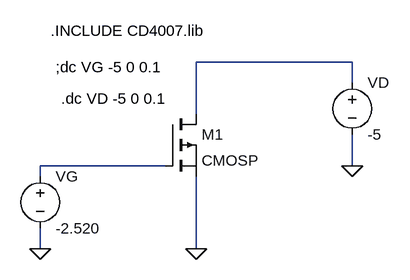
[diagram p0: schematic CMOSP_500muA.asc]
CMOSP_500muA.asc, the LTspice schematic file:
Version 4
SHEET 1 880 680
WIRE 464 48 224 48
WIRE 464 80 464 48
WIRE 224 128 224 48
WIRE 176 208 -16 208
WIRE 464 208 464 160
WIRE -16 224 -16 208
WIRE -16 336 -16 304
WIRE 224 336 224 224
FLAG -16 336 0
FLAG 224 336 0
FLAG 464 208 0
SYMBOL voltage -16 208 R0
SYMATTR InstName VG
SYMATTR Value -2.520
SYMBOL voltage 464 64 R0
SYMATTR InstName VD
SYMATTR Value -5
SYMBOL pmos 176 128 R0
SYMATTR InstName M1
SYMATTR Value CMOSP
TEXT 0 0 Left 2 !.INCLUDE CD4007.lib
TEXT 8 56 Left 2 !;dc VG -5 0 0.1
TEXT 16 104 Left 2 !.dc VD -5 0 0.1

The netlist it stands for:
* CMOSP_500muA.asc
VG N002 0 -2.520
VD N001 0 -5
M1 N001 N002 0 0 CMOSP
.model NMOS NMOS
.model PMOS PMOS
.lib standard.mos
.INCLUDE CD4007.lib
;dc VG -5 0 0.1
.dc VD -5 0 0.1
.backanno
.end